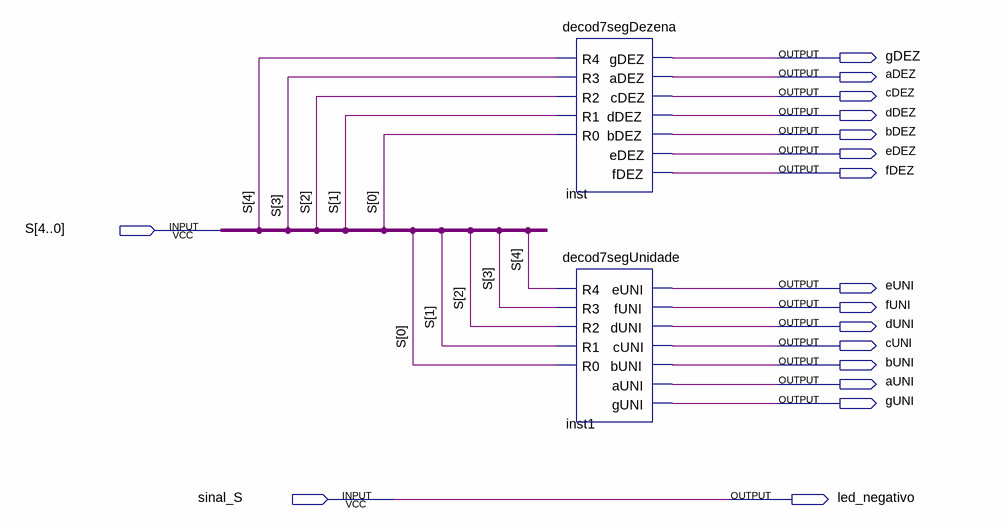
[diagram p0: schematic sheet]
// Quartus schematic decod7segSaida.bdf as structural Verilog: 2 symbols, 17 pins
module decod7segSaida (
  input  [4:0] S,
  input  sinal_S,
  output gDEZ,
  output aDEZ,
  output cDEZ,
  output dDEZ,
  output bDEZ,
  output eDEZ,
  output fDEZ,
  output eUNI,
  output fUNI,
  output dUNI,
  output cUNI,
  output bUNI,
  output aUNI,
  output gUNI,
  output led_negativo
);

  decod7segDezena inst (
    .R4(S[4]), .R3(S[3]), .R2(S[2]), .R1(S[1]), .R0(S[0]), .gDEZ(gDEZ), .aDEZ(aDEZ), .cDEZ(cDEZ),
    .dDEZ(dDEZ), .bDEZ(bDEZ), .eDEZ(eDEZ), .fDEZ(fDEZ));
  decod7segUnidade inst1 (
    .R4(S[4]), .R3(S[3]), .R2(S[2]), .R1(S[1]), .R0(S[0]), .eUNI(eUNI), .fUNI(fUNI), .dUNI(dUNI),
    .cUNI(cUNI), .bUNI(bUNI), .aUNI(aUNI), .gUNI(gUNI));

  assign led_negativo = sinal_S;
endmodule
